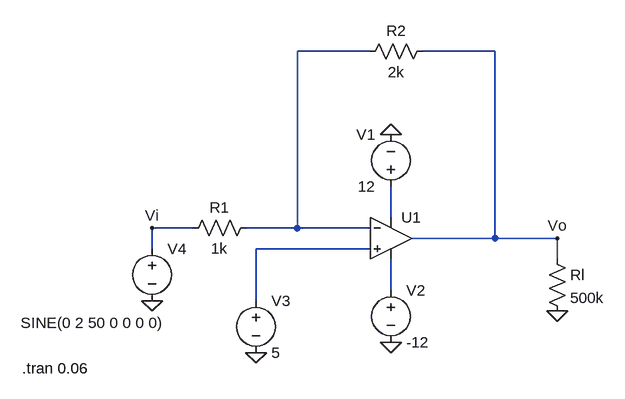
[diagram p0: schematic Draft1.asc]
Draft1.asc, the LTspice schematic file:
Version 4.1
SHEET 1 880 680
WIRE 160 -80 48 -80
WIRE 352 -80 240 -80
WIRE 192 176 192 128
WIRE -112 192 -176 192
WIRE 48 192 48 -80
WIRE 48 192 -32 192
WIRE 160 192 48 192
WIRE 352 208 352 -80
WIRE 352 208 224 208
WIRE 448 208 352 208
WIRE -176 224 -176 192
WIRE 160 224 -16 224
WIRE 448 240 448 208
WIRE 192 288 192 240
WIRE -16 304 -16 224
FLAG 192 48 0
FLAG 192 368 0
FLAG -16 384 0
FLAG -176 304 0
FLAG 448 320 0
FLAG 448 208 Vo
FLAG -176 192 Vi
SYMBOL OpAmps\\UniversalOpAmp 192 208 R0
SYMATTR InstName U1
SYMBOL voltage 192 144 R180
WINDOW 0 24 96 Left 2
WINDOW 3 24 16 Left 2
WINDOW 123 0 0 Left 0
WINDOW 39 0 0 Left 0
SYMATTR InstName V1
SYMATTR Value 12
SYMBOL voltage 192 272 R0
WINDOW 123 0 0 Left 0
WINDOW 39 0 0 Left 0
SYMATTR InstName V2
SYMATTR Value -12
SYMBOL res -128 208 R270
WINDOW 0 32 56 VTop 2
WINDOW 3 0 56 VBottom 2
SYMATTR InstName R1
SYMATTR Value 1k
SYMBOL voltage -16 288 R0
WINDOW 123 0 0 Left 0
WINDOW 39 0 0 Left 0
SYMATTR InstName V3
SYMATTR Value 5
SYMBOL voltage -176 208 R0
WINDOW 3 -202 130 Left 2
WINDOW 123 0 0 Left 0
WINDOW 39 0 0 Left 0
SYMATTR InstName V4
SYMATTR Value SINE(0 2 50 0 0 0 0)
SYMBOL res 432 224 R0
SYMATTR InstName Rl
SYMATTR Value 500k
SYMBOL res 256 -96 R90
WINDOW 0 0 56 VBottom 2
WINDOW 3 32 56 VTop 2
SYMATTR InstName R2
SYMATTR Value 2k
TEXT -376 408 Left 2 !.tran 0.06

The netlist it stands for:
* Draft1.asc
X§U1 N003 N001 N002 N004 Vo level1 Avol=1Meg GBW=10Meg Vos=0 En=0 Enk=0 In=0 Ink=0 Rin=500Meg  ; pins In+ In- V+ V- OUT
V1 N002 0 12
V2 N004 0 -12
R1 Vi N001 1k
V3 N003 0 5
V4 Vi 0 SINE(0 2 50 0 0 0 0)
Rl Vo 0 500k
R2 Vo N001 2k
.tran 0.06
.lib UniversalOpAmp1.lib
.backanno
.end